# Altium schematic sheet Complete_Buck_schematics.SchDoc
size A4
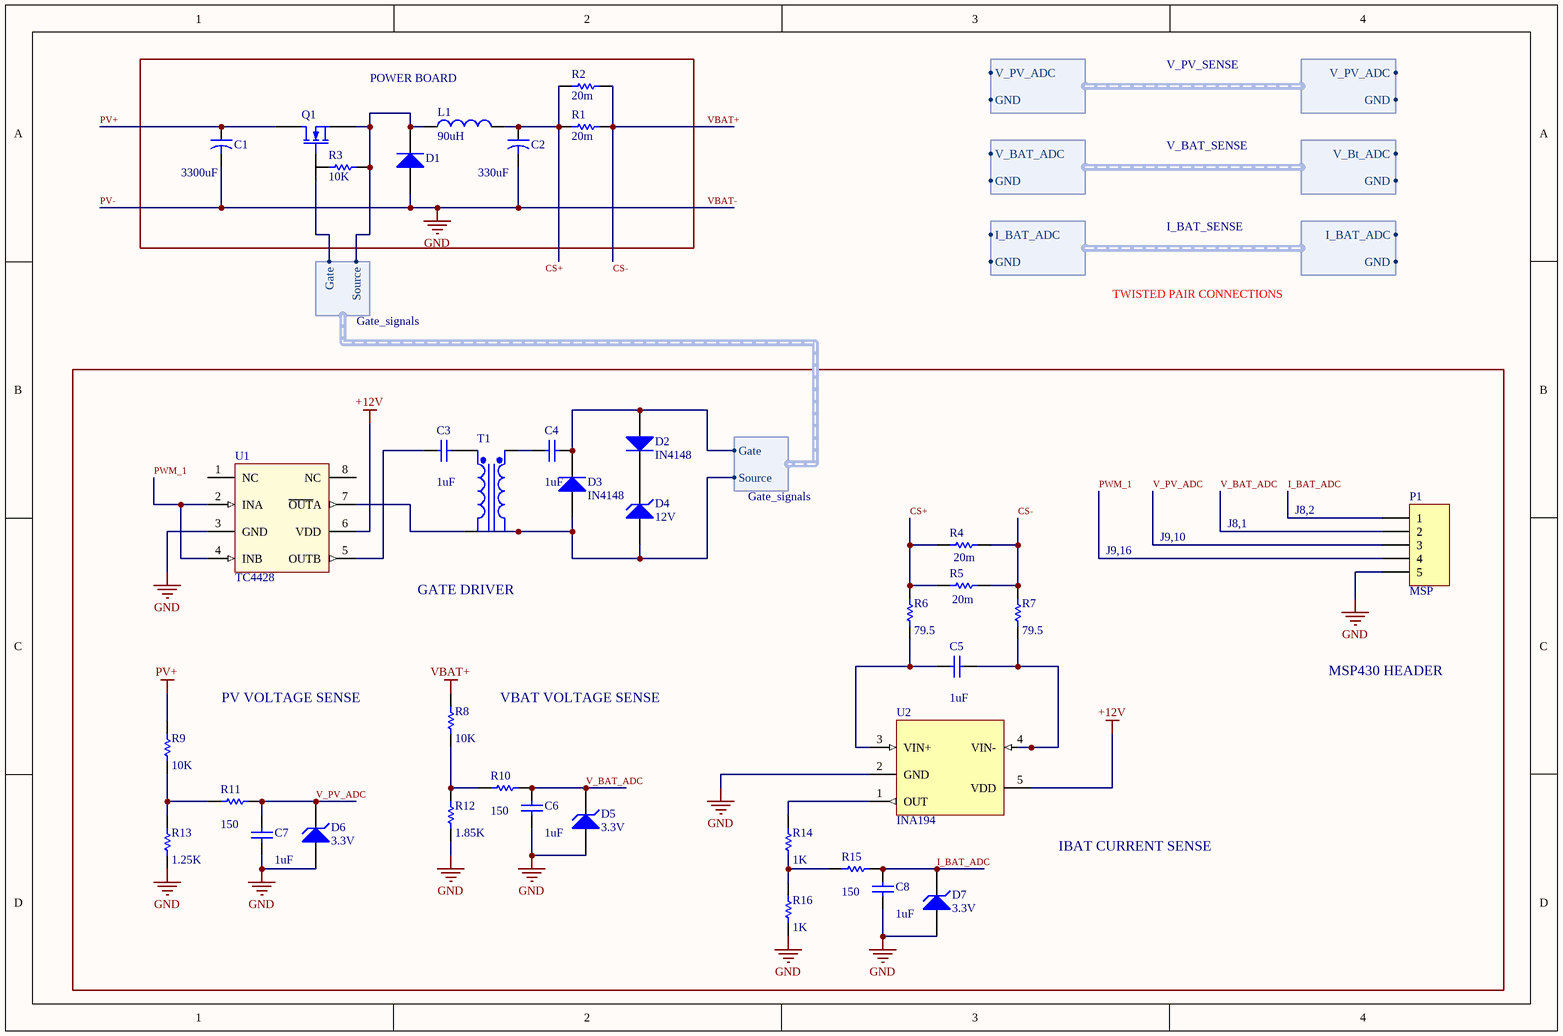
[diagram p0: Complete_Buck_schematics.SchDoc]

## Parts
C1  value 3300uF  [CAPR5-4X5]  (hidden comment: Cap2)
C2  value 330uF  [CAPR5-4X5]  (hidden comment: Cap2)
C3  value 1uF  [RAD-0.3]  (hidden comment: Cap)
C4  value 1uF  [RAD-0.3]  (hidden comment: Cap)
C5  value 1uF  [RAD-0.3]
C6  value 1uF  [RAD-0.3]
C7  value 1uF  [RAD-0.3]
C8  value 1uF  [RAD-0.3]
D1  Diode  [SMC]  (value not drawn)
D2  IN4148  [SMC]
D3  IN4148  [SMC]
D4  12V  [DIODE-0.7]
D5  3.3V  [DIODE-0.7]
D6  3.3V  [DIODE-0.7]
D7  3.3V  [DIODE-0.7]
L1  value 90uH  [0402-A]  (hidden comment: Inductor)
P1  MSP  [HDR1X5]
Q1  MOSFET-N  [E3]  (value not drawn)
R1  value 20m  [AXIAL-0.3]  (hidden comment: Res1)
R2  value 20m  [AXIAL-0.3]  (hidden comment: Res1)
R3  value 10K  [AXIAL-0.3]  (hidden comment: Res1)
R4  value 20m  [AXIAL-0.3]
R5  value 20m  [AXIAL-0.3]
R6  value 79.5  [AXIAL-0.3]
R7  value 79.5  [AXIAL-0.3]
R8  value 10K  [AXIAL-0.3]
R9  value 10K  [AXIAL-0.3]
R10  value 150  [AXIAL-0.3]
R11  value 150  [AXIAL-0.3]
R12  value 1.85K  [AXIAL-0.3]
R13  value 1.25K  [AXIAL-0.3]
R14  value 1K  [AXIAL-0.3]
R15  value 150  [AXIAL-0.3]
R16  value 1K  [AXIAL-0.3]
T1  Trans Ideal  [TRF_4]  (value not drawn)
U1  TC4428
U2  INA194

## Blocks framed on the sheet
POWER BOARD: C1 C2 D1 L1 Q1 R1-R3

## Harnesses
Gate_signals: Gate, Source
V_PV_SENSE: GND, V_PV_ADC
?: V_PV_ADC, GND
V_BAT_SENSE: GND, V_Bt_ADC
?: V_BAT_ADC, GND
I_BAT_SENSE: GND, I_BAT_ADC
?: I_BAT_ADC, GND

## Nets
+12V: U1.6(VDD) U2.5(VDD)
PV+: C1.1 Q1.1(D) R9.2
PV-: C1.2 C2.2 C6.1 C7.1 C8.1 D1.1(A) D5.1(A) D6.1(A) D7.1(A) P1.5 R12.1 R13.1 R16.2 U1.3(GND) U2.2(GND)  [also labelled GND, VBAT-]
VBAT+: R1.2 R2.2 R8.2
CS+: R4.2 R5.2 R6.1
CS-: R4.1 R5.1 R7.1
I_BAT_ADC: C8.2 D7.2(K) P1.1 R15.2
PWM_1: P1.4 U1.2(INA) U1.4(INB)
V_BAT_ADC: C6.2 D5.2(K) P1.2 R10.1
V_PV_ADC: C7.2 D6.2(K) P1.3 R11.2
NetC2_1: C2.1 L1.2 R1.1 R2.1
NetC3_1: C3.1 U1.5(OUTB)
NetC3_2: C3.2 T1.1(Pri+)
NetC4_1: C4.1 T1.3(Sec+)
NetC4_2: C4.2 D2.1(A) D3.2(K) Q1.2(G) ; harness Gate_signals.Gate
NetC5_1: C5.1 R7.2 U2.4(VIN-)
NetC5_2: C5.2 R6.2 U2.3(VIN+)
NetD1_2: D1.2(K) D3.1(A) D4.1(A) L1.1 Q1.3(S) R3.2 T1.4(Sec-) ; harness Gate_signals.Source
NetD2_2: D2.2(K) D4.2(K)
NetR8_1: R8.1 R10.2 R12.2
NetR9_1: R9.1 R11.1 R13.2
NetR14_1: R14.1 U2.1(OUT)
NetR14_2: R14.2 R15.1 R16.1
NetT1_2: T1.2(Pri-) U1.7(~{OUT}A)
(unnamed): harness V_PV_SENSE.GND, harness ?.GND
(unnamed): harness V_PV_SENSE.V_PV_ADC, harness ?.V_PV_ADC
(unnamed): harness V_BAT_SENSE.GND, harness ?.GND
(unnamed): harness I_BAT_SENSE.GND, harness ?.GND
(unnamed): harness I_BAT_SENSE.I_BAT_ADC, harness ?.I_BAT_ADC

Not connected (* = marked no-connect by the designer): R3 1; U1 1(NC) 8(NC)

## Notes on the sheet
- TWISTED PAIR CONNECTIONS
- J8,2
- J9,16
- J9,10
- J8,1
- (near T1) GATE DRIVER
- PV VOLTAGE SENSE
- (near R8) VBAT VOLTAGE SENSE
- MSP430 HEADER
- IBAT CURRENT SENSE
- Labels drawn without touching a wire or pin: CS+, CS-

## Library data of the parts
C1 C2 = Cap2: Capacitor; Published: 23-Sep-2002; PackageReference: CAPR5-4X5; Publisher: Altium Limited; PackageDescription: Capacitor; 2 Leads
C3-C8 = Cap: Capacitor; Published: 8-Jun-2000; LatestRevisionDate: 17-Jul-2002; LatestRevisionNote: Re-released for DXP Platform.; PackageReference: RAD-0.3; Publisher: Altium Limited; PackageDescription: Radial Cap, Thru-Hole; 2 Leads; 0.3 in Pin Spacing
D1-D3 = Diode: Default Diode; Published: 8-Jun-2000; LatestRevisionDate: 17-Jul-2002; LatestRevisionNote: Re-released for DXP Platform.; PackageVersion: Sep-1996; PackageReference: SMC; Publisher: Altium Limited; PackageDescription: DO-214-AB/SMC; 2 C-Bend Leads; Body 7.9 x 5.9 mm, inc. leads (LxW); Code_JEDEC: DO-214-AB
D4-D7 = D Zener: Zener Diode; Published: 8-Jun-2000; LatestRevisionDate: 17-Jul-2002; LatestRevisionNote: Re-released for DXP Platform.; PackageReference: DIODE-0.7; Publisher: Altium Limited; PackageDescription: Diode, Thru-Hole; 2 Leads; 0.7 in Pin Spacing
L1 = Inductor: Code_IEC: 1005; Published: 8-Jun-2000; LatestRevisionDate: 29-May-2009; LatestRevisionNote: IPC-7351 Footprint Added.; PackageReference: 0402-A; Publisher: Altium Limited; PackageDescription: Chip Inductor; Code_JEITA: 0402
P1 = Header 5: Header, 5-Pin; LatestRevisionDate: 17-Jul-2002; LatestRevisionNote: Re-released for DXP Platform.; Publisher: Altium Limited
Q1 = MOSFET-N: N-Channel MOSFET; Published: 8-Jun-2000; LatestRevisionDate: 17-Jul-2002; LatestRevisionNote: Re-released for DXP Platform.; PackageVersion: 1995/1996; PackageReference: E3; Publisher: Altium Limited; PackageDescription: TO, Flat Index; 3 In-Line, Axial Leads; Body Dia. 4.6mm; Lead Dia. 0.5 mm (max)
R1-R16 = Res1: Resistor; Published: 8-Jun-2000; LatestRevisionDate: 17-Jul-2002; LatestRevisionNote: Re-released for DXP Platform.; PackageReference: AXIAL-0.3; Publisher: Altium Limited; PackageDescription: Axial Device, Thru-Hole; 2 Leads; 0.3 in Pin Spacing
T1 = Trans Ideal: Transformer (Ideal); Published: 8-Jun-2000; LatestRevisionDate: 17-Jul-2002; LatestRevisionNote: Re-released for DXP Platform.; PackageReference: TRF_4; Publisher: Altium Limited; PackageDescription: Transformer; 4 Leads
U2 = INA194: CURRENT SHUNT MONITOR